# EasyEDA Pro project Sensores.epro

# Schematic Schematic4
Board Name: DW3000L/R; Create Date: 2025-05-28; Page Name: P1; Project Name: Sansone; Schematic Name: Schematic4; Update Date: 2025-10-13; Company: EasyEDA.com; Drawn: Maximo Huykman; Page Size: A4; Reviewed: Maximo Huykman; Version: V1.0
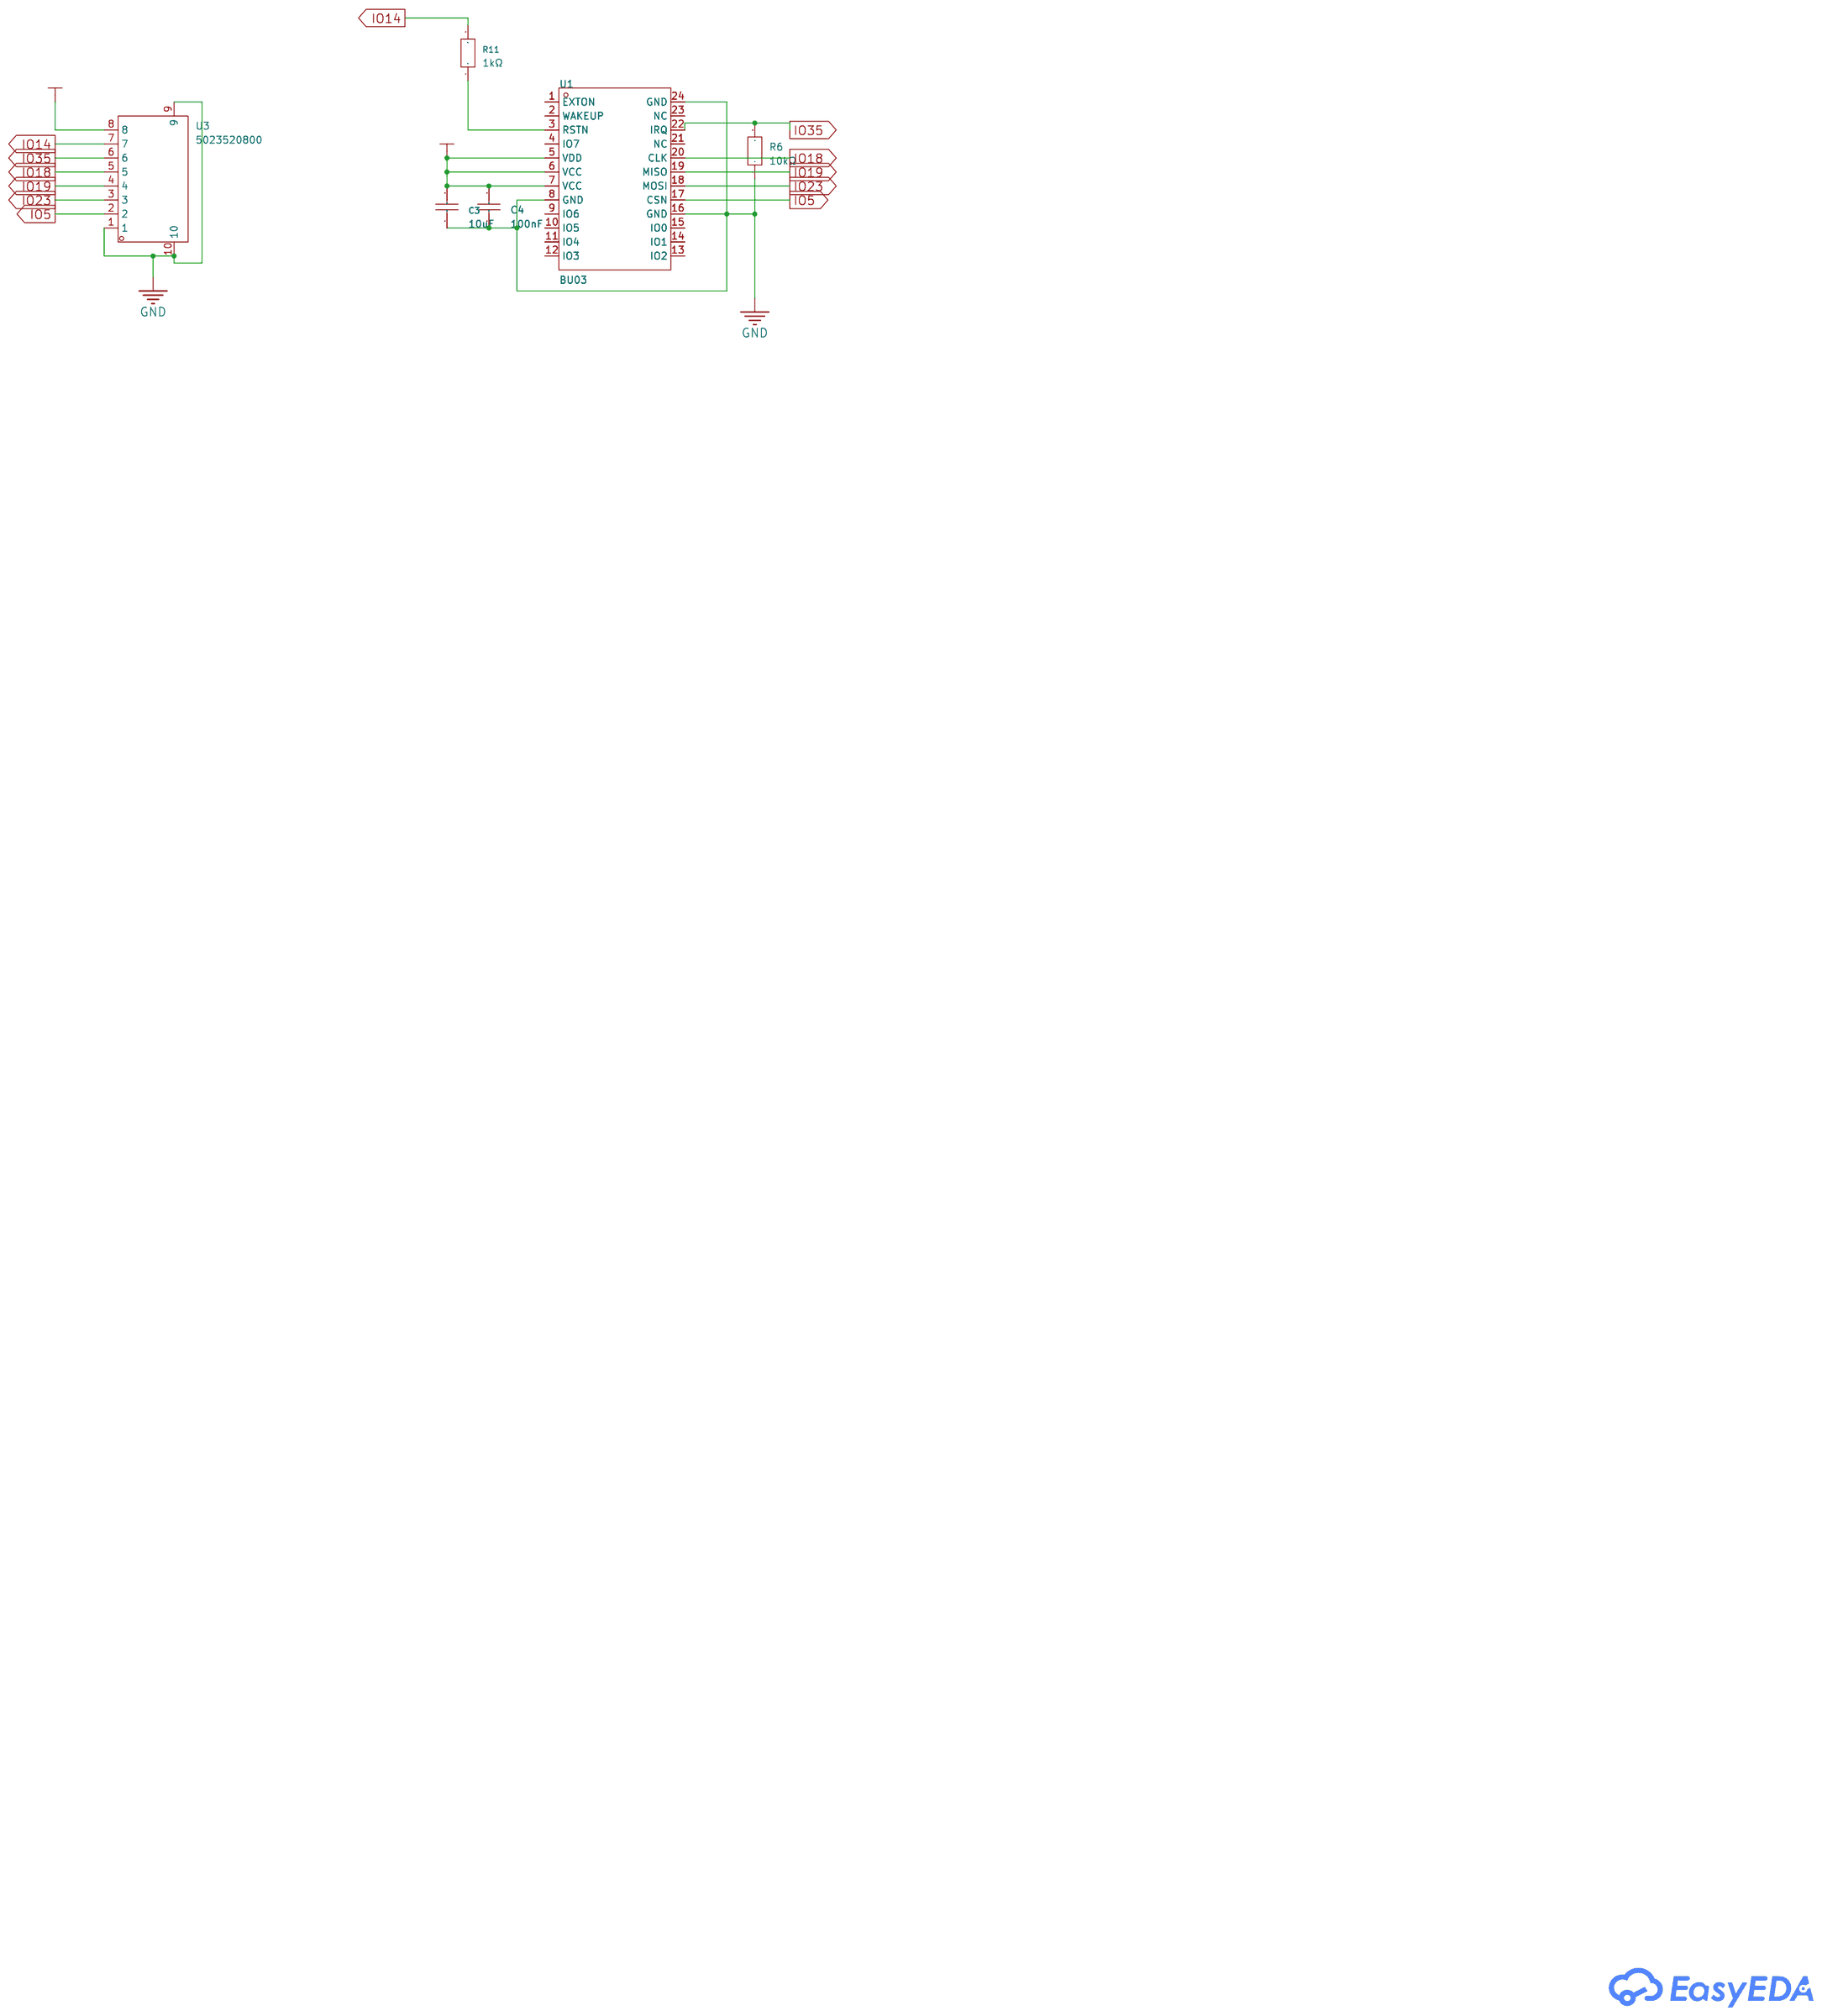
[diagram p0: schematic sheet]

## Parts
C3  10uF  [C0805]
C4  100nF  [C0805]
R6  10kΩ  [R0805]
R11  1kΩ  [R0805]
U1  BU03  [WIRELM-SMD_BU03]
U3  5023520800  [CONN-SMD_5023520800]

## Library data of the parts
C3 = CL21A106KPFNNNE: Capacitance: Tolerance:±10% Tolerance:±10% Voltage Rated: Temperature Coefficient:; LCSC Part Name: 10uF ±10% 10V; Supplier Part: C17024; Manufacturer: SAMSUNG(三星); Supplier Footprint: 0805; JLCPCB Part Class: Extended Part; Datasheet: https://atta.szlcsc.com/upload/public/pdf/source/20160218/1457707763339.pdf; Supplier: LCSC; Tolerance: ±10%
C4 = 0805B104J500NT: Capacitance:100nF Tolerance:±5% Tolerance:±5% Voltage Rating:50V Temperature Coefficient:X7R; LCSC Part Name: 100nF ±5% 50V; Supplier Part: C29926; Manufacturer: FH(风华); Supplier Footprint: 0805; JLCPCB Part Class: Extended Part; Datasheet: https://atta.szlcsc.com/upload/public/pdf/source/20200305/C486355_26A10D38EF8C2A5C37091D0039909270.pdf; Supplier: LCSC; Tolerance: ±5%; Voltage Rating: 50V; Temperature Coefficient: X7R
R6 = ERJP06F1002V: Type:Thick Film Resistors Resistance:10kΩ Tolerance:±1% Tolerance:±1% Power(Watts): Overload Voltage (Max):- Temperature Coefficient:±100ppm/℃ Temperature Coefficient:±100ppm/℃ Operating Temperature Range:-55℃~+155℃ Operating Temperature Range:-55℃~+155℃; LCSC Part Name: 10kΩ ±1% 500mW 厚膜电阻; Supplier Part: C543567; Manufacturer: PANASONIC(松下); Supplier Footprint: 0805; JLCPCB Part Class: Extended Part; Datasheet: https://atta.szlcsc.com/upload/public/pdf/source/20200515/C543414_D3FB4A44C151AC19BA141503575FC797.pdf; Supplier: LCSC; Type: Thick Film Resistors; Tolerance: ±1%; Temperature Coefficient: ±100ppm/℃; Operating Temperature Range: -55℃~+155℃
R11 = ERJP06F1001V: Type:Thick Film Resistors Resistance:1kΩ Tolerance:±1% Tolerance:±1% Power(Watts): Overload Voltage (Max):- Temperature Coefficient:±100ppm/℃ Temperature Coefficient:±100ppm/℃ Operating Temperature Range:-55℃~+155℃ Operating Temperature Range:-55℃~+155℃; LCSC Part Name: 1kΩ ±1% 500mW 厚膜电阻; Supplier Part: C441981; Manufacturer: PANASONIC(松下); Supplier Footprint: 0805; JLCPCB Part Class: Extended Part; Supplier: LCSC; Type: Thick Film Resistors; Tolerance: ±1%; Temperature Coefficient: ±100ppm/℃; Operating Temperature Range: -55℃~+155℃
U1 = BU03: Supplier Part: C42419011; Manufacturer: Ai-Thinker(安信可); Supplier Footprint: SMD,23x13mm; JLCPCB Part Class: Extended Part; Datasheet: https://atta.szlcsc.com/upload/public/pdf/source/20241223/DD33CB8A3691EFFD799F272BF7523F1A.pdf; Supplier: LCSC
U3 = 5023520800: Pins Structure:1x8P Pitch:2mm Mounting Style:Horizontal attachment Reference Series:- Number of Pins:8P Number of Rows:1 Number of PINs Per Row:8 Row Spacing:- Contact Material:Copper alloy Contact Plating:Tin; Supplier Part: C114105; Manufacturer: MOLEX; Supplier Footprint: SMD,P=2mm,卧贴; JLCPCB Part Class: Extended Part; Datasheet: https://www.molex.com/content/dam/molex/molex-dot-com/products/automated/en-us/salesdrawingpdf/502/502352/5023520800_sd.pdf?inline\; Supplier: LCSC; Pins Structure: 1x8P; Pitch: 2mm; Mounting Style: Horizontal attachment; Number of Pins: 8P; Number of Rows: 1; Number of PINs Per Row: 8; Contact Material: Copper alloy; Contact Plating: Tin

## Nets
+3V3: C3.2 C4.2 U1.5(VDD) U1.6(VCC) U1.7(VCC) U3.8
GND: C3.1 C4.1 R6.1 U1.8(GND) U1.16(GND) U1.24(GND) U3.1 U3.9 U3.10
IO5: U1.17(CSN) U3.2
IO14: R11.2 U3.7
IO18: U1.20(CLK) U3.5
IO19: U1.19(MISO) U3.4
IO23: U1.18(MOSI) U3.3
IO35: R6.2 U1.22(IRQ) U3.6
$1N1070: R11.1 U1.3(RSTN)

Not connected (* = marked no-connect by the designer): U1 1(EXTON) 2(WAKEUP) 4(IO7) 9(IO6) 10(IO5) 11(IO4) 12(IO3) 13(IO2) 14(IO1) 15(IO0) 21(NC) 23(NC)

# Board PCB4
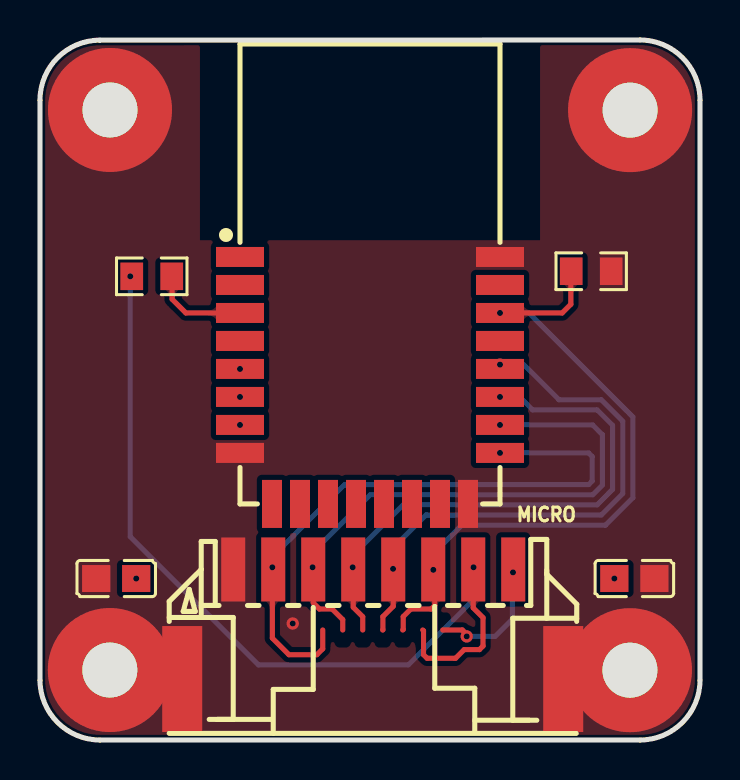
[diagram p1: board, top side]
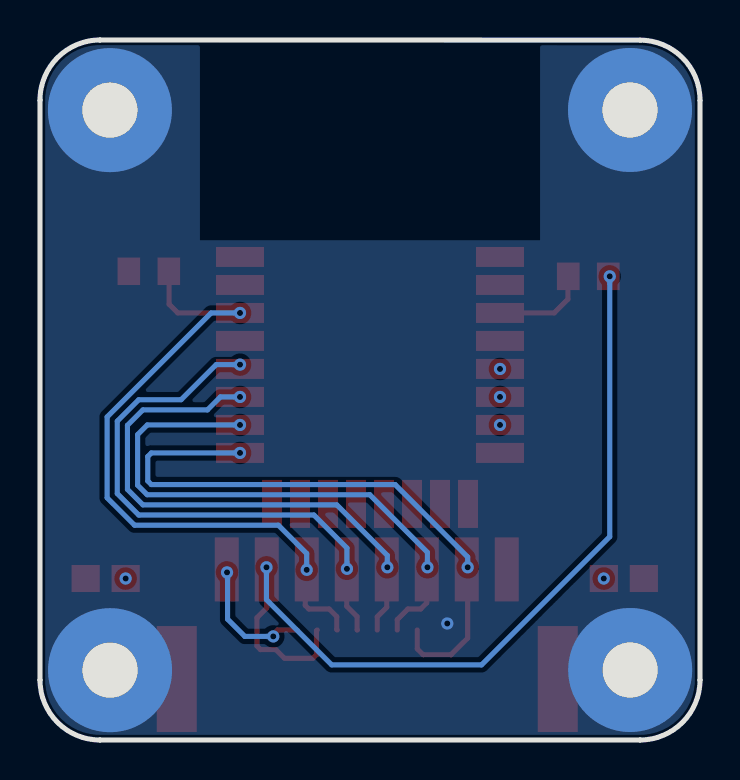
[diagram p2: board, bottom side, seen from below]

Outline 33 x 35.01 mm; copper layers: Top Layer, GND, PWR, Bottom Layer. Coordinates in mm from the lower left corner of the outline.
Outline path: 0,32 arc(0.88,34.12) 3,35 30,35.01 arc(32.12,34.13) 33,32 33,3 arc(32.12,0.88) 30,0 3,0 arc(0.88,0.88) 0,3 0,32
Stack: Top Layer 0.035mm Outer layer thickness 1oz / Dielectric1 0.2104mm 7628 RC49% 8.6mil / GND 0.0152mm Inner layer thickness / Dielectric2 1.065mm 1.1mm H/HOZ Copper / PWR 0.0152mm Inner layer thickness / Dielectric3 0.2104mm 7628 RC49% 8.6mil / Bottom Layer 0.035mm Outer layer thickness 1oz

## Design rules (mm)
template: Custom Config
spacing copperThickness1oz (default): track to track 0.102, other pairs 0.152 to 0.3
spacing copperThickness2oz: track to track 0.203, other pairs 0.152 to 0.3
track width copperThickness1oz (default): min 0.127, default 0.254, max 2.54
track width copperThickness2oz: min 0.203, default 0.254, max 2.54
differential pair differentialPair (default): width min 0.127, default 0.254, max 2.54; gap min 0.152, default 0.152
via viaSize (default): diameter min 0.5, default 0.61, max 10; hole min 0.3, default 0.305, max 6.3

## Placement (name value [footprint] x y rotation side)
C3  10uF  [C0805]  3.81 8.08 0 top
C4  100nF  [C0805]  29.72 8.08 180 top
MICRO  5023520800  [CONN-SMD_5023520800]  16.64 5.79 0 top
NOREF  -  [Pad_e16]  3.5 31.51 0 top
NOREF#2  -  [Pad_e22]  3.49 3.5 90 top
NOREF#3  -  [Pad_e18]  29.5 31.5 270 top
NOREF#4  -  [Pad_e20]  29.5 3.49 180 top
R6  10kΩ  [R0805]  27.56 23.44 180 top
R11  1kΩ  [R0805]  5.59 23.19 180 top
U1  BU03  [WIRELM-SMD_BU03]  16.5 17.98 0 top

## Footprints (pads in the part's own frame, mm; a bottom-side part is the same pattern mirrored in y, then rotated)
C0805
  rect 1.41x1.35 smd: 1(-1,0) 2(1,0)
CONN-SMD_5023520800
  rect 1.2x3.2 smd: 1(-6.975,2.74) 2(-4.975,2.74) 3(-2.975,2.74) 4(-0.975,2.74) 5(1.025,2.74) 6(3.025,2.74) 7(5.025,2.74) 8(7.025,2.74)
  rect 2x5.3 smd: 9(9.525,-2.74) 10(-9.525,-2.74)
Pad_e16
  round 6.2 hole 2.75: 2(0,0)
Pad_e18
  round 6.2 hole 2.75: 2(0,0)
Pad_e20
  round 6.2 hole 2.75: 2(0,0)
Pad_e22
  round 6.2 hole 2.75: 2(0,0)
R0805
  rect 1.133x1.377 smd: 1(-1,0) 2(1,0)
WIRELM-SMD_BU03
  rect 2.4x1 smd: 1(-6.5,6.175) 2(-6.5,4.775) 3(-6.5,3.375) 4(-6.5,1.975) 5(-6.5,0.575) 6(-6.5,-0.825) 7(-6.5,-2.225) 8(-6.5,-3.625) 17(6.5,-3.625) 18(6.5,-2.225) 19(6.5,-0.825) 20(6.5,0.575) 21(6.5,1.975) 22(6.5,3.375) 23(6.5,4.775) 24(6.5,6.175)
  rect 1x2.4 smd: 9(-4.9,-6.175) 10(-3.5,-6.175) 11(-2.1,-6.175) 12(-0.7,-6.175) 13(0.7,-6.175) 14(2.1,-6.175) 15(3.5,-6.175) 16(4.9,-6.175)

## Nets
+3V3: C3.2 C4.2 MICRO.8 U1.5 U1.6 U1.7
GND: C3.1 C4.1 MICRO.1 MICRO.9 MICRO.10 NOREF.2 NOREF#2.2 NOREF#3.2 NOREF#4.2 R6.1 U1.8 U1.16 U1.24
IO5: MICRO.2 U1.17
IO14: MICRO.7 R11.2
IO18: MICRO.5 U1.20
IO19: MICRO.4 U1.19
IO23: MICRO.3 U1.18
IO35: MICRO.6 R6.2 U1.22
$1N1070: R11.1 U1.3

Pads without a net: U1 1 2 4 9 10 11 12 13 14 15 21 23

## Via types
v1: diameter 0.61, hole 0.305, Top Layer to Bottom Layer, 20 vias

## Routing (per net, layer and track width the routed paths; a pad name or vN(x,y) marks a point on that pad's centre or on a via; arc(x,y) is an arc through that point)
+3V3: length 6.3
  Top Layer w0.254: 21.34,5.28 21.12,5.5 20.14,5.5
  Bottom Layer w0.254: v1(21.34,5.18) 22.76,5.18 23.62,6.04 23.62,8.36 v1(23.65,8.38)
  vias: v1(4.81,8.08) v1(10,18.56) v1(10,17.16) v1(10,15.76) v1(28.72,8.08)
GND:
  vias: v1(12.64,5.83)
IO5: length 31.5
  Top Layer w0.254: v1(11.62,8.64) 11.62,5.09 12.45,4.27 13.84,4.27 14.14,4.56 14.14,5.5
  Bottom Layer w0.254: v1(23,14.36) 27.43,14.36 27.61,14.18 27.61,12.95 27.43,12.78 15.24,12.78 11.62,9.15 v1(11.62,8.64)
IO14: length 44.4
  Top Layer w0.254: MICRO.7 21.66,6.61 22.15,6.12 22.15,4.7 21.97,4.52 21.21,4.52 20.78,4.09 19.36,4.09 19.18,4.27 19.18,5.46 19.14,5.5
  Bottom Layer w0.254: v1(21.68,8.64) 21.68,7.02 18.41,3.76 10.92,3.76 4.51,10.17 v1(4.51,23.19)
IO18: length 27.8
  Top Layer w0.254: 17.14,5.5 17.15,5.51 17.15,6.17 17.66,6.69 MICRO.5
  Bottom Layer w0.254: v1(17.65,8.56) 17.65,9.6 19.3,11.25 28.06,11.25 29.14,12.32 29.14,15.95 28.06,17.02 25.94,17.02 24.19,18.77 v1(23,18.77)
IO19: length 27.6
  Top Layer w0.254: MICRO.4 15.66,6.64 16.14,6.16 16.14,5.5
  Bottom Layer w0.254: v1(23,17.16) 23.98,17.16 24.63,16.51 27.85,16.51 28.63,15.74 28.63,12.53 27.85,11.76 18.16,11.76 15.63,9.23 v1(15.63,8.64)
IO23: length 28.5
  Top Layer w0.254: MICRO.3 13.66,6.86 13.97,6.55 14.6,6.55 15.14,6.02 15.14,5.5
  Bottom Layer w0.254: v1(23,15.76) 27.63,15.76 28.12,15.27 28.12,12.74 27.64,12.27 16.51,12.27 13.63,9.39 v1(13.63,8.64)
IO35: length 34.5
  Top Layer w0.254: 18.14,5.5 18.16,5.53 18.16,6.17 18.54,6.55 19.56,6.55 19.74,6.73 19.74,8.45 MICRO.6 ; R6.2 26.54,23.43 26.54,21.79 26.11,21.36 v1(23,21.36)
  Bottom Layer w0.254: v1(19.66,8.51) 19.66,9.33 21.08,10.74 28.27,10.74 29.64,12.11 29.64,16.16 24.44,21.36 v1(23,21.36)
$1N1070: length 4.8
  Top Layer w0.254: U1.3 7.29,21.36 6.6,22.05 6.6,23.17 R11.1

## Copper pours and planes (outline as drawn; the poured copper is in the pictures)
+3V3 on PWR: -0.13,35.25 32.87,35.25 32.87,0.25 -0.13,0.25
GND on Top Layer: 0.02,35 33.02,35 33.02,0 0.02,0
GND on Bottom Layer: 0,35 33,35 33,0 0,0
GND on GND: 0.02,35 33.02,35 33.02,0 0.02,0

Small or netless copper shapes (teardrops, artwork), in the pictures only: 18 on Top Layer, 14 on Bottom Layer
